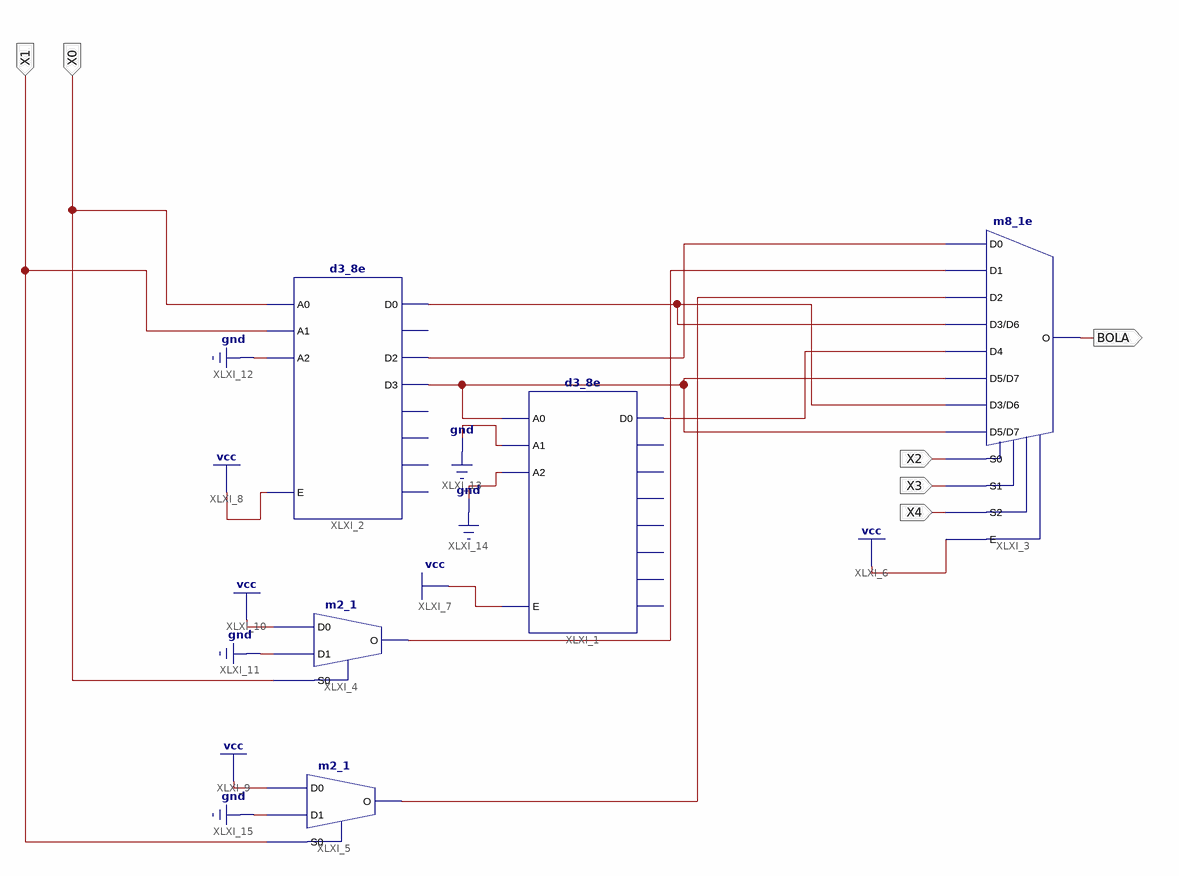
[diagram p0: schematic sheet 1]
// Xilinx ISE schematic p2ej3.sch (spartan3) as structural Verilog: 5 symbols, 6 ports
module p2ej3 (
  input  X1,
  input  X0,
  input  X2,
  input  X3,
  input  X4,
  output BOLA
);

  wire XLXN_8, XLXN_10, XLXN_11, XLXN_15, XLXN_16, XLXN_28;

  d3_8e XLXI_1 (.A0(XLXN_15), .A1(1'b0), .A2(1'b0), .E(1'b1), .D0(XLXN_16));  // open: D1, D2, D3, D4, D5, D6, D7
  d3_8e XLXI_2 (
    .A0(X0), .A1(X1), .A2(1'b0), .E(1'b1), .D0(XLXN_11), .D2(XLXN_8), .D3(XLXN_15));  // open: D1, D4, D5, D6, D7
  m8_1e XLXI_3 (
    .D0(XLXN_8), .D1(XLXN_28), .D2(XLXN_10), .D3(XLXN_11), .D4(XLXN_16), .D5(XLXN_15), .D6(XLXN_11),
    .D7(XLXN_15), .E(1'b1), .S0(X2), .S1(X3), .S2(X4), .O(BOLA));
  m2_1 XLXI_4 (.D0(1'b1), .D1(1'b0), .S0(X0), .O(XLXN_28));
  m2_1 XLXI_5 (.D0(1'b1), .D1(1'b0), .S0(X1), .O(XLXN_10));
endmodule
